# Altium schematic sheet SwitchingRegulators.SchDoc
size Letter; SheetNumber: 2; SheetTotal: 3
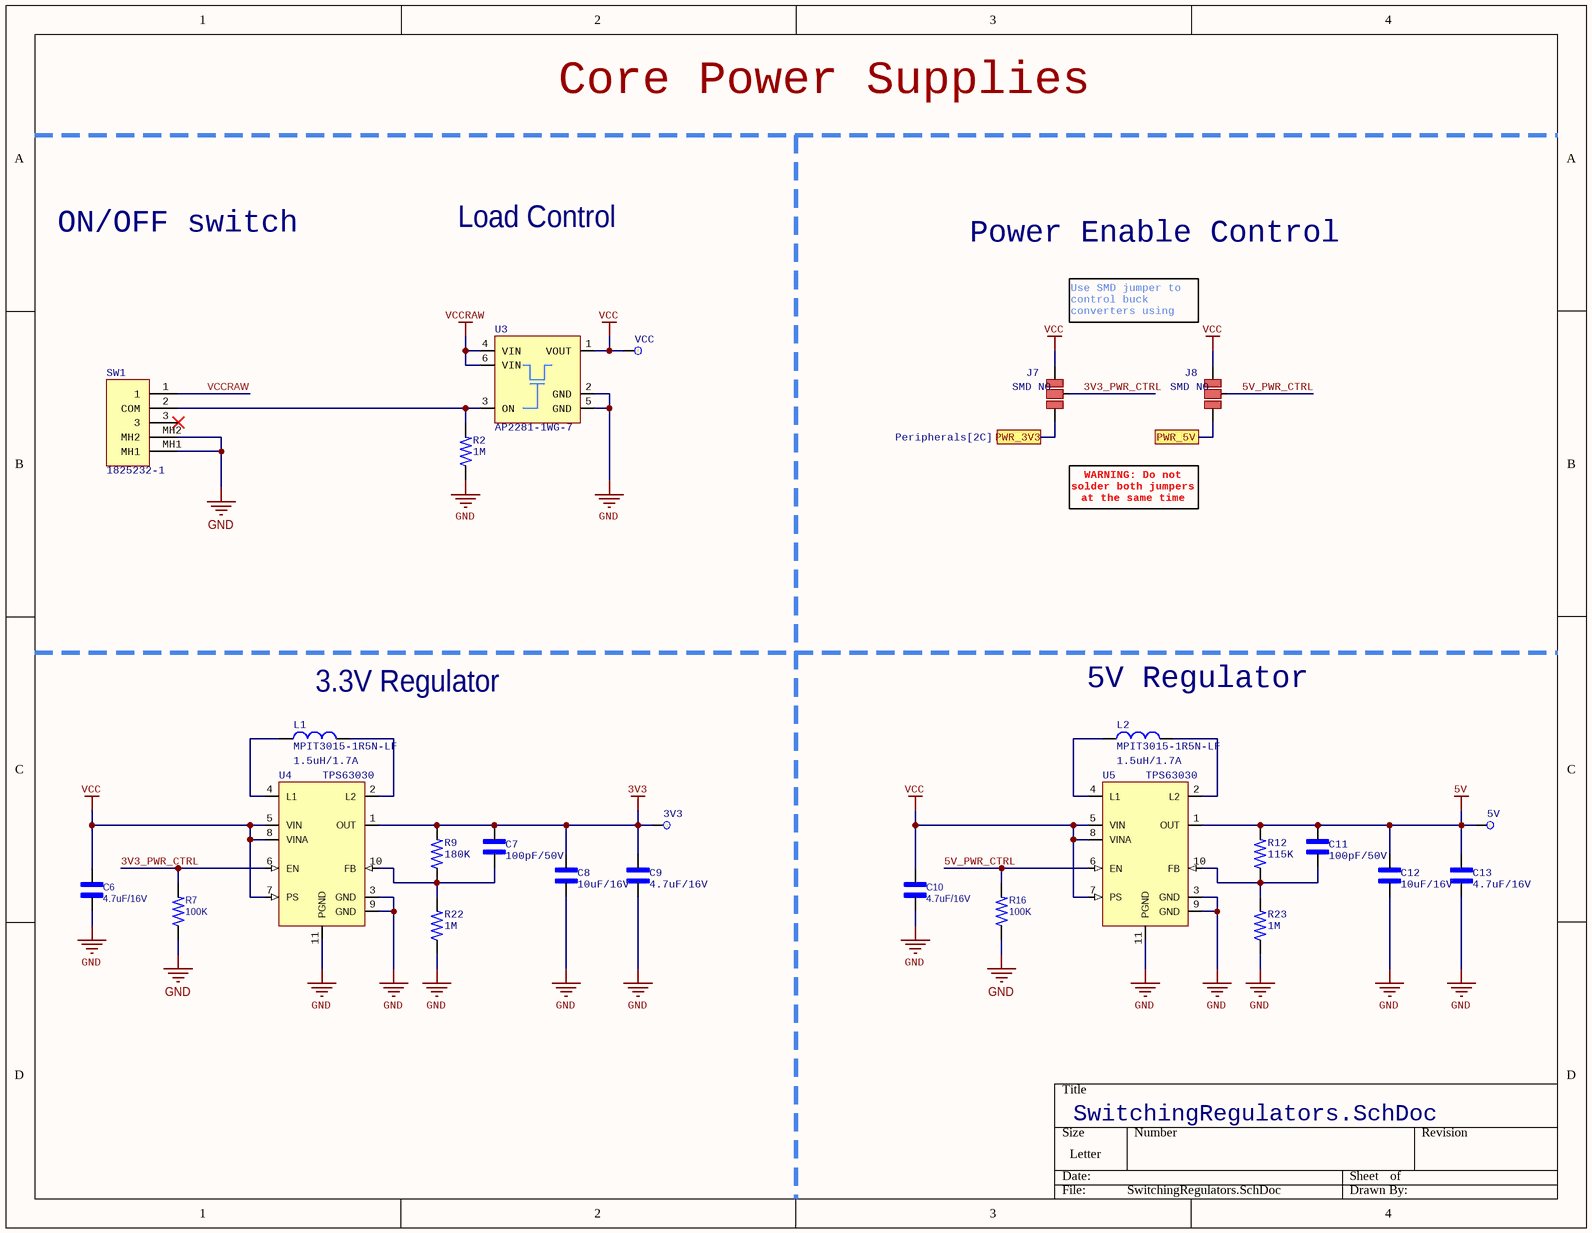
[diagram p0: SwitchingRegulators.SchDoc]

## Parts
3V3  Test point 1.2mm  [TEST_POINT_1.2MM]  (value not drawn)  (no BOM)
5V  Test point 1.2mm  [TEST_POINT_1.2MM]  (value not drawn)  (no BOM)
C6  4.7uF/16V  [C0603]
C7  100pF/50V  [C0603]
C8  10uF/16V  [C0603]
C9  4.7uF/16V  [C0603]
C10  4.7uF/16V  [C0603]
C11  100pF/50V  [C0603]
C12  10uF/16V  [C0603]
C13  4.7uF/16V  [C0603]
J7  SMD NO  [JUMPER_SMD_NO_2WAY]  (net tie, no BOM)
J8  SMD NO  [JUMPER_SMD_NO_2WAY]  (net tie, no BOM)
L1  1.5uH/1.7A  [L3030_SHIELD_H15]
L2  1.5uH/1.7A  [L3030_SHIELD_H15]
R2  1M  [R0603]
R7  100K  [R0603]
R9  180K  [R0603]
R12  115K  [R0603]
R16  100K  [R0603]
R22  1M  [R0603]
R23  1M  [R0603]
SW1  1825232-1  [1825232-1]
U3  AP2281-1WG-7  [SOT-26-6]
U4  TPS63030  [WSON-N10]
U5  TPS63030  [WSON-N10]
VCC  Test point 1.2mm  [TEST_POINT_1.2MM]  (value not drawn)  (no BOM)

## Ports
PWR_3V3 (see Peripherals[2C]), PWR_5V (see Peripherals[2C])

## Nets
3V3: 3V3.1 C7.1 C8.1 C9.1 R9.2 U4.1(OUT)
5V: 5V.1 C11.1 C12.1 C13.1 R12.2 U5.1(OUT)
GND: C6.2 C8.2 C9.2 C10.2 C12.2 C13.2 R2.1 R7.1 R16.1 R22.1 R23.1 SW1.MH1 SW1.MH2 U3.2(GND) U3.5(GND) U4.3(GND) U4.9(GND) U4.11(PGND) U5.3(GND) U5.9(GND) U5.11(PGND)
VCC: C6.1 C10.1 J7.3 J8.3 U3.1(VOUT) U4.5(VIN) U4.7(PS) U4.8(VINA) U5.5(VIN) U5.7(PS) U5.8(VINA) VCC.1
VCCRAW: SW1.1 U3.4(VIN) U3.6(VIN)
3V3_PWR_CTRL: J7.2 R7.2 U4.6(EN)
5V_PWR_CTRL: J8.2 R16.2 U5.6(EN)
PWR_3V3: J7.1 ; port PWR_3V3
PWR_5V: J8.1 ; port PWR_5V
NetC7_2: C7.2 R9.1 R22.2 U4.10(FB)
NetC11_2: C11.2 R12.1 R23.2 U5.10(FB)
NetL1_1: L1.1 U4.4(L1)
NetL1_2: L1.2 U4.2(L2)
NetL2_1: L2.1 U5.4(L1)
NetL2_2: L2.2 U5.2(L2)
NetR2_2: R2.2 SW1.2(COM) U3.3(ON)

Not connected (* = marked no-connect by the designer): SW1 3*

## Notes on the sheet
- Core Power Supplies
- ON/OFF switch
- Load Control
- Power Enable Control
- Use SMD jumper to control buck converters using MCU
- WARNING: Do not solder both jumpers at the same time
- (near L1) 3.3V Regulator
- (near L2) 5V Regulator

## Library data of the parts
3V3 5V VCC = Test point: SMD test point
C6 C9 C10 C13 = C0603 4.7uF/16V: MLCC 0603 4.7uF 16V 10% X5R; Manufacturer 1: Murata; Manufacturer Part Number 1: GRT188R61C475KE13D; Supplier 1: Mouser; Supplier Part Number 1: 81-GRT188R61C475KE3D; RoHS: Yes; Category: Ceramic Capacitors; Stock 1: 39950; Pricing 1: 1=0.16, 10=0.066, 50=0.066, 100=0.038, 1000=0.034, 10000=0.029 (USD); RoHS Compliant: Yes; Mounting Technology: Surface Mount; Case/Package: 0603; Case Code (Metric): 1608; Case Code (Imperial): 0603; Min Operating Temperature: -55°C; Max Operating Temperature: 85°C; Packaging: Cut Tape; Value: 4.7uF; Voltage Rating: 16V; Tolerance: 10%; Series: GRT; Length: 0.063inch; Width: 0.031inch; Thickness: 0.035inch; Ratings: AEC-Q200
C7 C11 = C0603 100pF/50V: AVX - 06035A101JAT2A - SMD Multilayer Ceramic Capacitor, 100 pF, 5%, C0G / NP0, 50 V, 0603 [1608 Metric] RoHS Compliant: Yes; Manufacturer: Kyocera AVX; Capacitance: 100pF; Voltage Rating (DC): 50V; Temperature Coefficient: 30ppm/°C; Insulation Resistance: 100GR; Supplier 1: Mouser; Supplier Part Number 1: 581-06035A101J; Manufacturer Part Number: 06035A101JAT2A; RoHS: Yes; Category: Ceramic Capacitors; Stock 1: 438925; Pricing 1: 1=0.10000, 10=0.04100, 50=0.04100, 100=0.03300, 1000=0.01900, 10000=0.01200 (USD); Mount: Surface Mount,PCB; Case/Package: 0603; Number of Pins: 2; Case Code (Metric): 1608; Case Code (Imperial): 0603; Min Operating Temperature: -55°C; Max Operating Temperature: 125°C; Tolerance: 5%; Dielectric: C0G; Packaging: Tape and Reel; Voltage: 50V; Voltage Rating: 50V; Package Quantity: 1; Termination: SMD/SMT; Length: 1.6mm; Width: 0.032inch; Height: 0.9mm; Depth: 0.81mm; Thickness: 0.035inch; Radiation Hardening: No; REACH SVHC: No SVHC; Lead Free: Lead Free; RoHS Compliant: Yes; Supplier 2: Mouser; Supplier Part Number 2: 77-VJ0603A101JXAAC
C8 C12 = C0603 10uF/16V: MLCC 0603 10uF 16V 20% X5R; Manufacturer 1: Murata; Manufacturer Part Number 1: GRM188R61C106MAALD; Material: Ceramic; Supplier 1: Mouser; Supplier Part Number 1: 81-GRM188R61C106MALD; RoHS: Yes; Category: Ceramic Capacitors; Stock 1: 9439; Pricing 1: 1=0.38000, 10=0.27100, 50=0.27100, 100=0.16200, 1000=0.10300, 10000=0.08800 (USD); Mount: Surface Mount; Case/Package: 0603; Case Code (Metric): 1608; Case Code (Imperial): 0603; Min Operating Temperature: -55°C; Max Operating Temperature: 85°C; Packaging: Cut Tape; Capacitance: 10uF; Voltage Rating: 16V; Tolerance: 20%; Voltage Rating (DC): 16V; Length: 0.063inch; Width: 0.031inch; Height: 0.8mm; Thickness: 0.037inch; Lead Free: Lead Free; Supplier 2: Mouser; Supplier Part Number 2: 81-ZRB18AR61C106ME1L; Supplier 3: Mouser; Supplier Part Number 3: 810-C1608X5R1C106M
J7 J8 = JUMPER_SMD_NO_2WAY
L1 L2 = MPIT3015-1R5N-LF: Inductor Power Shielded Wirewound 1.5uH 20% 152MHz Metal 2.3A 0.05Ohm DCR 1212 T/R; Manufacturer 1: microgate; Supplier 1: LCSC; Supplier Part Number 1: C486478; RoHS: Yes; Category: Fixed Inductors; Manufacturer Part Number 1: MPIT3015-1R5N-LF
R2 = R0603 1M: RES SMD 1M OHM 1% 1/10W 0603; Manufacturer: Yageo; Manufacturer Part Number: RC0603FR-071ML; Voltage Rating: 75V; Voltage Rating (DC): 50V; Resistance: 1MR; Power Rating: 100mW; Temperature Coefficient: 100ppm/°C; Application(s): HIGH RELIABILITY; Supplier 1: Mouser; Supplier Part Number 1: 603-RC0603FR-071ML; RoHS: Yes; Category: Chip SMD Resistors; Stock 1: 1321822; Pricing 1: 1=0.10000, 10=0.01800, 50=0.01800, 100=0.00700, 1000=0.00400, 10000=0.00200 (USD); Case/Package: 0603; Number of Pins: 2; Case Code (Imperial): 0603; Case Code (Metric): 1608; Weight: 0.000847oz; Min Operating Temperature: -55°C; Max Operating Temperature: 155°C; Tolerance: 1%; Packaging: Cut Tape; Package Quantity: 5000; Termination: SMD/SMT; Resistor Type: Thick Film; Type: General Purpose; Series: RC; Technology: THICK FILM; Length: 1.6mm; Width: 0.8mm; Height: 0.45mm; Depth: 0.8mm; RoHS Compliant: Yes; REACH SVHC: No SVHC; Military Standard: Not; Lead Free: Lead Free
R7 R16 = R0603 100K: RES 0603 100K OHM 1% 1/10W; Manufacturer: Yageo; Manufacturer Part Number: RC0603FR-07100KL; Resistance: 100kR; Power Rating: 100mW; Voltage Rating: 50V; Temperature Coefficient: 100ppm/°C; Working Voltage: 75V; RoHS: Yes; Category: Chip SMD Resistors; Stock 1: 4536807; Pricing 1: 1=0.10000, 10=0.02100, 100=0.00900, 1000=0.00400, 5000=0.00300, 10000=0.00200 (USD); Case/Package: 0603; Number of Pins: 2; Case Code (Imperial): 0603; Case Code (Metric): 1608; Min Operating Temperature: -55°C; Max Operating Temperature: 155°C; Tolerance: 1%; Packaging: Tape and Reel; Resistor Type: Thick Film; Termination: SMD/SMT; Voltage Rating (DC): 50V; Length: 1.6mm; Depth: 0.8mm; REACH SVHC: No SVHC; Military Standard: Not; Lead Free: Lead Free; Supplier 1: Mouser; Supplier Part Number 1: 603-RC0603FR-07100KL; Number of Terminations: 2; Height: 0.45mm; Width: 0.8mm
R9 = R0603 220K: RES 0603 220K OHM 1% 1/10W; Manufacturer 1: Yageo; Manufacturer Part Number 1: RC0603FR-07220KL; Power Rating: 100mW; Voltage Rating: 50V; Temperature Coefficient: 100ppm/°C; Resistance: 220kR; Supplier 1: Mouser; Supplier Part Number 1: 603-RC0603FR-07220KL; RoHS: Yes; Category: Chip SMD Resistors; Stock 1: 155701; Pricing 1: 1=0.10000, 10=0.02400, 50=0.02400, 100=0.01000, 1000=0.00400, 10000=0.00300 (USD); Case/Package: 0603; Case Code (Metric): 1608; Case Code (Imperial): 0603; Min Operating Temperature: -55°C; Max Operating Temperature: 155°C; Packaging: Tape and Reel; Tolerance: 1%; Number of Terminations: 2; Termination: SMD/SMT; Max Power Dissipation: 100mW; Series: RC; Length: 0.063inch; Width: 0.031inch; Height: 0.022inch; RoHS Compliant: Yes; Features: Moisture Resistant; Number of Pins: 2; Size Code: 0603; Voltage Rating (DC): 50V; Package Quantity: 1; Resistor Type: Thick Film; Technology: THICK FILM; Resistance Tolerance: 1%; Depth: 0.8mm; REACH SVHC: No SVHC; Lead Free: Lead Free
R12 = R0603 220K: RES 0603 115K OHM 1% 1/10W; Manufacturer 1: Yageo; Manufacturer Part Number 1: RC0603FR-07220KL; Power Rating: 100mW; Voltage Rating: 50V; Temperature Coefficient: 100ppm/°C; Resistance: 220kR; Supplier 1: Mouser; Supplier Part Number 1: 603-RC0603FR-07220KL; RoHS: Yes; Category: Chip SMD Resistors; Stock 1: 155701; Pricing 1: 1=0.10000, 10=0.02400, 50=0.02400, 100=0.01000, 1000=0.00400, 10000=0.00300 (USD); Case/Package: 0603; Case Code (Metric): 1608; Case Code (Imperial): 0603; Min Operating Temperature: -55°C; Max Operating Temperature: 155°C; Packaging: Tape and Reel; Tolerance: 1%; Number of Terminations: 2; Termination: SMD/SMT; Max Power Dissipation: 100mW; Series: RC; Length: 0.063inch; Width: 0.031inch; Height: 0.022inch; RoHS Compliant: Yes; Features: Moisture Resistant; Number of Pins: 2; Size Code: 0603; Voltage Rating (DC): 50V; Package Quantity: 1; Resistor Type: Thick Film; Technology: THICK FILM; Resistance Tolerance: 1%; Depth: 0.8mm; REACH SVHC: No SVHC; Lead Free: Lead Free
R22 = R0603 1M: RES 0603 1M OHM 1% 1/10W; Manufacturer 1: Yageo; Manufacturer Part Number 1: RC0603FR-071ML; Voltage Rating: 75V; Voltage Rating (DC): 50V; Resistance: 1MR; Power Rating: 100mW; Temperature Coefficient: 100ppm/°C; Application(s): HIGH RELIABILITY; Supplier 1: Mouser; Supplier Part Number 1: 603-RC0603FR-071ML; RoHS: Yes; Category: Chip SMD Resistors; Stock 1: 1321822; Pricing 1: 1=0.10000, 10=0.01800, 50=0.01800, 100=0.00700, 1000=0.00400, 10000=0.00200 (USD); RoHS Compliant: Yes; Case/Package: 0603; Number of Pins: 2; Case Code (Imperial): 0603; Case Code (Metric): 1608; Weight: 0.000847oz; Min Operating Temperature: -55°C; Max Operating Temperature: 155°C; Tolerance: 1%; Packaging: Cut Tape; Package Quantity: 5000; Termination: SMD/SMT; Resistor Type: Thick Film; Type: General Purpose; Series: RC; Technology: THICK FILM; Length: 1.6mm; Width: 0.8mm; Height: 0.45mm; Depth: 0.8mm; REACH SVHC: No SVHC; Military Standard: Not; Lead Free: Lead Free
R23 = R0603 2M: RES 0603 2M OHM 1% 1/10W; Manufacturer 1: Vishay; Manufacturer Part Number 1: CRCW06032M00FKEAC; Supplier 1: Mouser; Supplier Part Number 1: 71-CRCW06032M00FKEAC; RoHS: Yes; Category: Chip SMD Resistors; Stock 1: 40195; Pricing 1: 1=0.10000, 10=0.04300, 50=0.04300, 100=0.01800, 1000=0.00900, 10000=0.00500 (USD); RoHS Compliant: Yes; Supplier 2: Digi-Key; Supplier Part Number 2: 541-5333-1-ND
SW1 = 1825232-1: Slide Switch, SPDT, On-on, Latched, 0.2A, 30VDC, Solder Terminal, Panel Mount; Manufacturer: TE Connectivity AMP; Mechanical Life: 10000Cycles; Actuator Material: Nylon; Voltage Rating (DC): 30V; Current Rating: 200mA; Operating Force: 200gf; Switch Travel: 2mm; Number of Positions: 2; PCB Mount Retention: With; Actuator Type: Standard; Actuator Length: 0.118inch; Tail Length: 0.094inch; Manufacturer Part Number: 1825232-1; RoHS: Yes; Category: Slide Switches; Stock 1: 12457; Pricing 1: 1=0.4, 10=0.382, 50=0.361, 100=0.321, 1000=0.247, 10000=0.24 (USD); Mounting Technology: Through Hole; Contact Material: Copper Alloy; Contact Plating: Silver; Min Operating Temperature: -20°C; Max Operating Temperature: 70°C; Throw Configuration: SPDT; Package Quantity: 19200; Packaging: Tray; Max Voltage Rating (DC): 30V; Termination: PC Pin; Electrical Life: 10000Cycles; Orientation: Right Angle; Contact Current Rating: 200mA; Switch Function: On-On; Type: Switch; Length: 0.3563inch; Width: 4.3mm; ELV: Compliant; Flammability Rating: UL94 HB; RoHS Compliant: Yes; ComponentLink1URL: https://datasheet.ciiva.com/15085/eng-cd-1825232-b2-15085854.pdf?src-supplier=Digi-Key; ComponentLink1Description: https://datasheet.ciiva.com/15085/eng-cd-1825232-b2-15085854.pdf?src-supplier=Digi-Key; Supplier 1: Mouser; Supplier Part Number 1: 655-1825232-1; Supplier 2: Digi-Key; Supplier Part Number 2: A107673-ND
U3 = AP2281-1WG-7: Load Switch P-Channel 2A SOT-26-6; Manufacturer: Diodes; Number of Outputs: 1; Max Power Dissipation: 720mW; Output Current: 0A; Max Supply Voltage: 6V; Min Supply Voltage: 1.5V; On-State Resistance: 210mR; Interface: On/Off; Output Configuration: High Side; On-state Resistance-Max: 100MR; Supplier 1: Mouser; Supplier Part Number 1: 621-AP2281-1WG-7; Manufacturer Part Number: AP2281-1WG-7; RoHS: Yes; Stock 1: 4712; Pricing 1: 1=0.66000, 10=0.57900, 50=0.57900, 100=0.44400, 250=0.41200, 500=0.35100, 1000=0.28100, 3000=0.25400, 6000=0.23900, 9000=0.23700, 10000=0.23700 (USD); Category: Hot Swap Controllers; Mount: Surface Mount; Case/Package: SOT-26; Number of Pins: 6; Min Operating Temperature: -40°C; Max Operating Temperature: 85°C; Packaging: Tape and Reel; Package Quantity: 3000; Current Rating: 2A; Max Output Current: 2A; Power Dissipation: 720mW; Series: -; Rated Current-Max: 2A; Radiation Hardening: No; REACH SVHC: No SVHC; Lead Free: Lead Free; RoHS Compliant: Yes; Supplier 2: LCSC; Supplier Part Number 2: C127279
U4 U5 = TPS63030DSKR: Buck-Boost Switching Regulator IC Positive Adjustable 1.2V 1 Output 900mA (Switch) 10-WFDFN Exposed Pad; Manufacturer 1: Texas Instruments; Quiescent Current: 25uA; Output Voltage: 5.5V; Output Current: 800mA; Min Input Voltage: 1.8V; Number of Outputs: 1; Switching Frequency: 2.4MHz; Synchronous Rectifier: Yes; Efficiency: 96%; Supply Current: 50uA; Supplier 1: Mouser; Supplier Part Number 1: 595-TPS63030DSKR; RoHS: Yes; Manufacturer Part Number 1: TPS63030DSKR; Category: Voltage Regulators - Switching; Stock: 10596; Pricing: 1=1.91, 10=1.64, 50=1.64, 100=1.41, 1000=1.01, 10000=0.886 (USD); Mounting Technology: Surface Mount; Case/Package: SON; Pins: 10; Min Operating Temperature: -40°C; Max Operating Temperature: 85°C; Packaging: Tape and Reel; Package Quantity: 3000; Max Output current: 800mA; Max Supply Voltage: 5.5V; Operating Supply Voltage: 5.5V; Output Type: Adjustable; Series: -; Min Output Voltage: 1.2V; Max Output Voltage: 5.5V; Topology: Buck-Boost; Min Supply Voltage: 1.8V; Output Configuration: Positive; Radiation Hardening: No; Lead Free: Lead Free; RoHS Compliant: Yes; Reach SVHC Compliant: No; Supplier 2: LCSC; Supplier Part Number 2: C12462